# Altium project LedBoard.PrjPcb
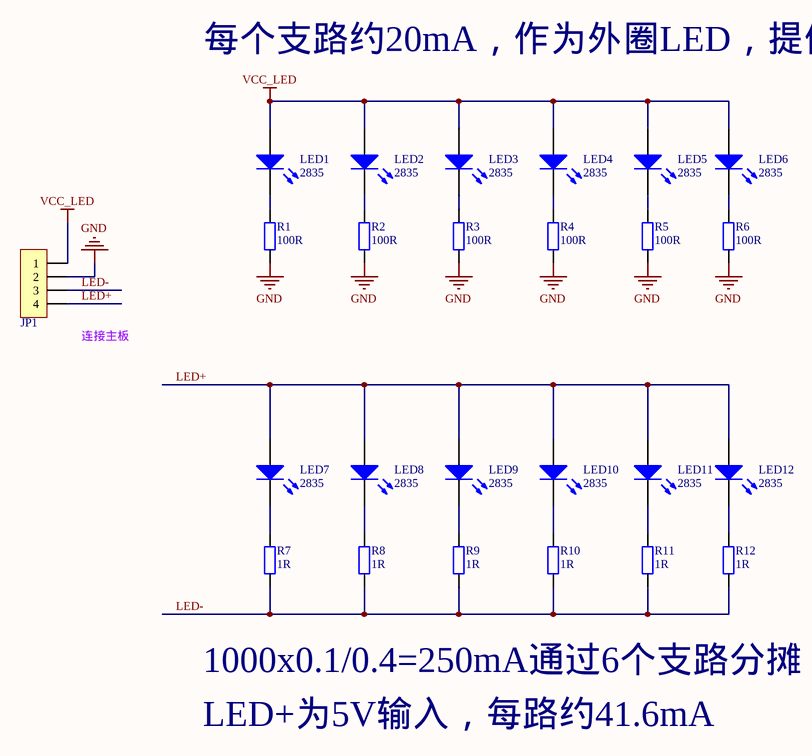
[diagram p0: LED.SchDoc]
1 sheet, 25 parts. Net scope: global (net labels, ports and power ports of the same name join across sheets).
Board file: LED.PcbDoc

## Sheet LED.SchDoc
size A4; SheetNumber: 1; SheetTotal: 1

### Parts
JP1  HDR-1X4  [MX1.25-L-4P]  (value not drawn)
LED1  2835  [LED 2835-2P]
LED2  2835  [LED 2835-2P]
LED3  2835  [LED 2835-2P]
LED4  2835  [LED 2835-2P]
LED5  2835  [LED 2835-2P]
LED6  2835  [LED 2835-2P]
LED7  2835  [LED 2835-2P]
LED8  2835  [LED 2835-2P]
LED9  2835  [LED 2835-2P]
LED10  2835  [LED 2835-2P]
LED11  2835  [LED 2835-2P]
LED12  2835  [LED 2835-2P]
R1  100R  [R0603_L]
R2  100R  [R0603_L]
R3  100R  [R0603_L]
R4  100R  [R0603_L]
R5  100R  [R0603_L]
R6  100R  [R0603_L]
R7  1R  [R1206_L]
R8  1R  [R1206_L]
R9  1R  [R1206_L]
R10  1R  [R1206_L]
R11  1R  [R1206_L]
R12  1R  [R1206_L]

### Nets
GND: JP1.2 R1.1 R2.1 R3.1 R4.1 R5.1 R6.1
VCC_LED: JP1.1 LED1.1(A) LED2.1(A) LED3.1(A) LED4.1(A) LED5.1(A) LED6.1(A)
LED+: JP1.4 LED7.1(A) LED8.1(A) LED9.1(A) LED10.1(A) LED11.1(A) LED12.1(A)
LED-: JP1.3 R7.1 R8.1 R9.1 R10.1 R11.1 R12.1
NetLED1_2: LED1.2(K) R1.2
NetLED2_2: LED2.2(K) R2.2
NetLED3_2: LED3.2(K) R3.2
NetLED4_2: LED4.2(K) R4.2
NetLED5_2: LED5.2(K) R5.2
NetLED6_2: LED6.2(K) R6.2
NetLED7_2: LED7.2(K) R7.2
NetLED8_2: LED8.2(K) R8.2
NetLED9_2: LED9.2(K) R9.2
NetLED10_2: LED10.2(K) R10.2
NetLED11_2: LED11.2(K) R11.2
NetLED12_2: LED12.2(K) R12.2

### Notes on the sheet
- 每个支路约20mA，作为外圈LED，提供泛光效果
- (near JP1) 连接主板
- 1000x0.1/0.4=250mA通过6个支路分摊
- LED+为5V输入，每路约41.6mA

### Library data of the parts
JP1 = Header 4: 4P连接器; 联系卖家 免费技术支持: 封装库来自淘宝卖家ID：黄晶宝石; BOM名称: 4P连接器
LED1-LED12 = LED-2835: 0.2W 功率LED; BOM名称: 三基色LED; 封装库来自淘宝卖家：黄晶宝石: 其他店铺购入均为盗版封装库，无更新权益，请立即申请退款，本店现金奖励200~1000元
R1-R12 = R: 贴片电阻; 联系下单店铺卖家 免费帮你查找封装: 联系下单店铺卖家 免费技术支持; BOM名称: 贴片电阻